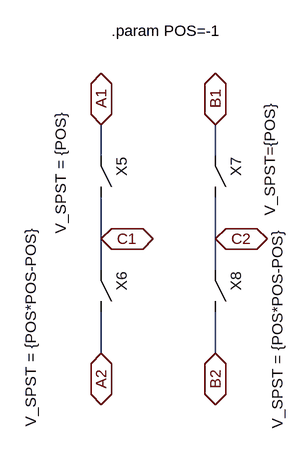
[diagram p0: schematic 2PDT_OnOn.asc]
2PDT_OnOn.asc, the LTspice schematic file:
Version 4
SHEET 1 1432 680
WIRE 832 192 832 144
WIRE 1008 192 1008 144
WIRE 832 320 832 256
WIRE 1008 320 1008 256
WIRE 832 368 832 320
WIRE 1008 368 1008 320
WIRE 832 496 832 432
WIRE 1008 496 1008 432
FLAG 832 144 A1
IOPIN 832 144 BiDir
FLAG 1008 144 B1
IOPIN 1008 144 BiDir
FLAG 832 320 C1
IOPIN 832 320 BiDir
FLAG 1008 320 C2
IOPIN 1008 320 BiDir
FLAG 832 496 A2
IOPIN 832 496 BiDir
FLAG 1008 496 B2
IOPIN 1008 496 BiDir
SYMBOL 1PST 832 224 R90
WINDOW 39 -4 78 Bottom 2
SYMATTR InstName X5
SYMATTR SpiceLine V_SPST = {POS}
SYMBOL 1PST 832 400 R90
WINDOW 39 58 124 Bottom 2
SYMATTR InstName X6
SYMATTR SpiceLine V_SPST = {POS*POS-POS}
SYMBOL 1PST 1008 224 R90
WINDOW 39 -26 -68 Bottom 2
SYMATTR InstName X7
SYMATTR SpiceLine V_SPST={POS}
SYMBOL 1PST 1008 400 R90
WINDOW 39 61 -80 Bottom 2
SYMATTR InstName X8
SYMATTR SpiceLine V_SPST = {POS*POS-POS}
TEXT 848 0 Left 2 !.param POS=-1

The netlist it stands for:
* 2PDT_OnOn.asc
XX5 A1 C1 1PST V_SPST = {POS}  ; pins In Out
XX6 C1 A2 1PST V_SPST = {POS*POS-POS}  ; pins In Out
XX7 B1 C2 1PST V_SPST={POS}  ; pins In Out
XX8 C2 B2 1PST V_SPST = {POS*POS-POS}  ; pins In Out
.param POS=-1
.backanno
.end